# Altium schematic sheet TBarLedWindow.schDOC
size A4; Organization: Altium Limited; Address1: L3, 12a Rodborough Rd; Address2: Frenchs Forest; Address3: NSW; Address4: Australia 2086; DocumentNumber: 2; SheetNumber: 2; SheetTotal: 22
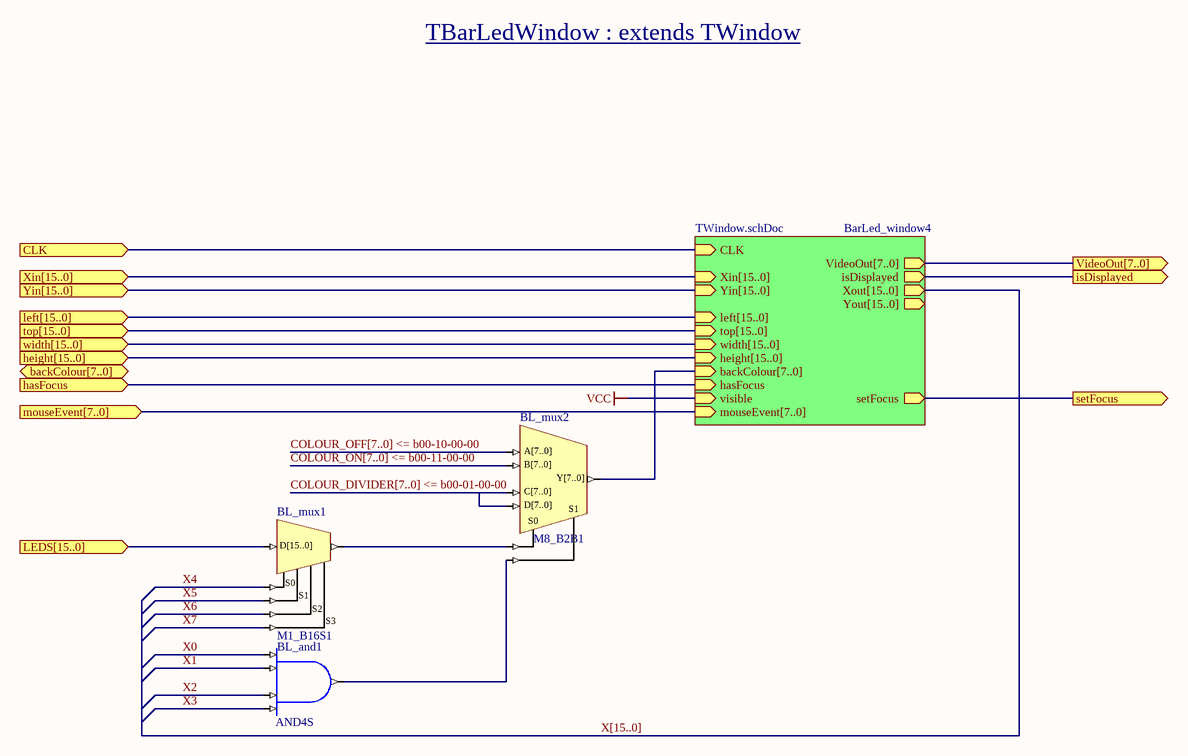
[diagram p0: TBarLedWindow.schDOC]

## Parts
BL_and1  AND4S
BL_mux1  M1_B16S1
BL_mux2  M8_B2B1

## Sub-sheets
BarLed_window4 = TWindow.schDoc: CLK (in), VideoOut[7..0] (out), Xin[15..0] (in), Yin[15..0] (in), top[15..0] (in), width[15..0] (in), height[15..0] (in), left[15..0] (in), Xout[15..0] (out), Yout[15..0] (out), backColour[7..0] (in), isDisplayed (out), visible (in), hasFocus (in), mouseEvent[7..0] (in), setFocus (out)

## Ports
backColour[7..0] (in), CLK (in), hasFocus (in), height[15..0] (in), isDisplayed (out), LEDS[15..0] (in), left[15..0] (in), mouseEvent[7..0] (in), setFocus (out), top[15..0] (in), VideoOut[7..0] (out), width[15..0] (in), Xin[15..0] (in), Yin[15..0] (in)

## Nets
VCC: sheet BarLed_window4/visible
CLK: port CLK, sheet BarLed_window4/CLK
COLOUR_DIVIDER[7..0] <= b00-01-00-00: BL_mux2.C[7..0] BL_mux2.D[7..0]
COLOUR_OFF[7..0] <= b00-10-00-00: BL_mux2.A[7..0]
COLOUR_ON[7..0] <= b00-11-00-00: BL_mux2.B[7..0]
hasFocus: port hasFocus, sheet BarLed_window4/hasFocus
isDisplayed: port isDisplayed, sheet BarLed_window4/isDisplayed
LEDS[15..0]: BL_mux1.D[15..0] ; port LEDS[15..0]
setFocus: port setFocus, sheet BarLed_window4/setFocus
X0: BL_and1.I0
X1: BL_and1.I1
X2: BL_and1.I2
X3: BL_and1.I3
X4: BL_mux1.S0
X5: BL_mux1.S1
X6: BL_mux1.S2
X7: BL_mux1.S3
NetBL_and1_O: BL_and1.O BL_mux2.S1
NetBL_mux1_O: BL_mux1.O BL_mux2.S0
NetBL_mux2_Y[7..0]: BL_mux2.Y[7..0] ; sheet BarLed_window4/backColour[7..0]

## Buses and harness runs
bus COLOUR_DIVIDER[7..0] <= b00-01-00-00
bus COLOUR_OFF[7..0] <= b00-10-00-00
bus COLOUR_ON[7..0] <= b00-11-00-00
bus port height[15..0] = sheet BarLed_window4/height[15..0]
bus port left[15..0] = sheet BarLed_window4/left[15..0]
bus port mouseEvent[7..0] = sheet BarLed_window4/mouseEvent[7..0]
bus port top[15..0] = sheet BarLed_window4/top[15..0]
bus port VideoOut[7..0] = sheet BarLed_window4/VideoOut[7..0]
bus port width[15..0] = sheet BarLed_window4/width[15..0]
bus port Xin[15..0] = sheet BarLed_window4/Xin[15..0]
bus port Yin[15..0] = sheet BarLed_window4/Yin[15..0]
bus X[15..0] = sheet BarLed_window4/Xout[15..0]

## Notes on the sheet
- TBarLedWindow : extends TWindow
- Title
- Size:
- Date:
- A4
- Number:
- Time:
- Revision:
- Sheet
- of
- File:

## Library data of the parts
BL_and1 = AND4S: 4-Input AND Gate, Single Pin Version; ArchiveName: GENERIC; XilinxEquivalent: AND4; FunctionalClass: Logic Primitive; PortSize: 4; VHDLIB_SIM: GENERIC_LIB; Published: 29-Jan-2004; Publisher: Altium Limited; LastRevisionNo: 1.00.00; HelpURL: CR0118 FPGA Generic Library Guide.pdf#page=113; SubClass: AND; PortStyle: Single Pin Version
BL_mux1 = M1_B16S1: 1x16-Bit Bus to 1x1-Single Wire Multiplexer; ArchiveName: GENERIC; Published: 9-30-2003; Publisher: Altium Limited; Core Revision: 1.00.00
BL_mux2 = M8_B4B1: 4x8-Bit Bus to 1x8-Bit Bus Multiplexer; ArchiveName: GENERIC; Published: 9-30-2003; Publisher: Altium Limited; Core Revision: 1.00.00